# EAGLE schematic KFTP-ESP12 (EAGLE 9.7.0)
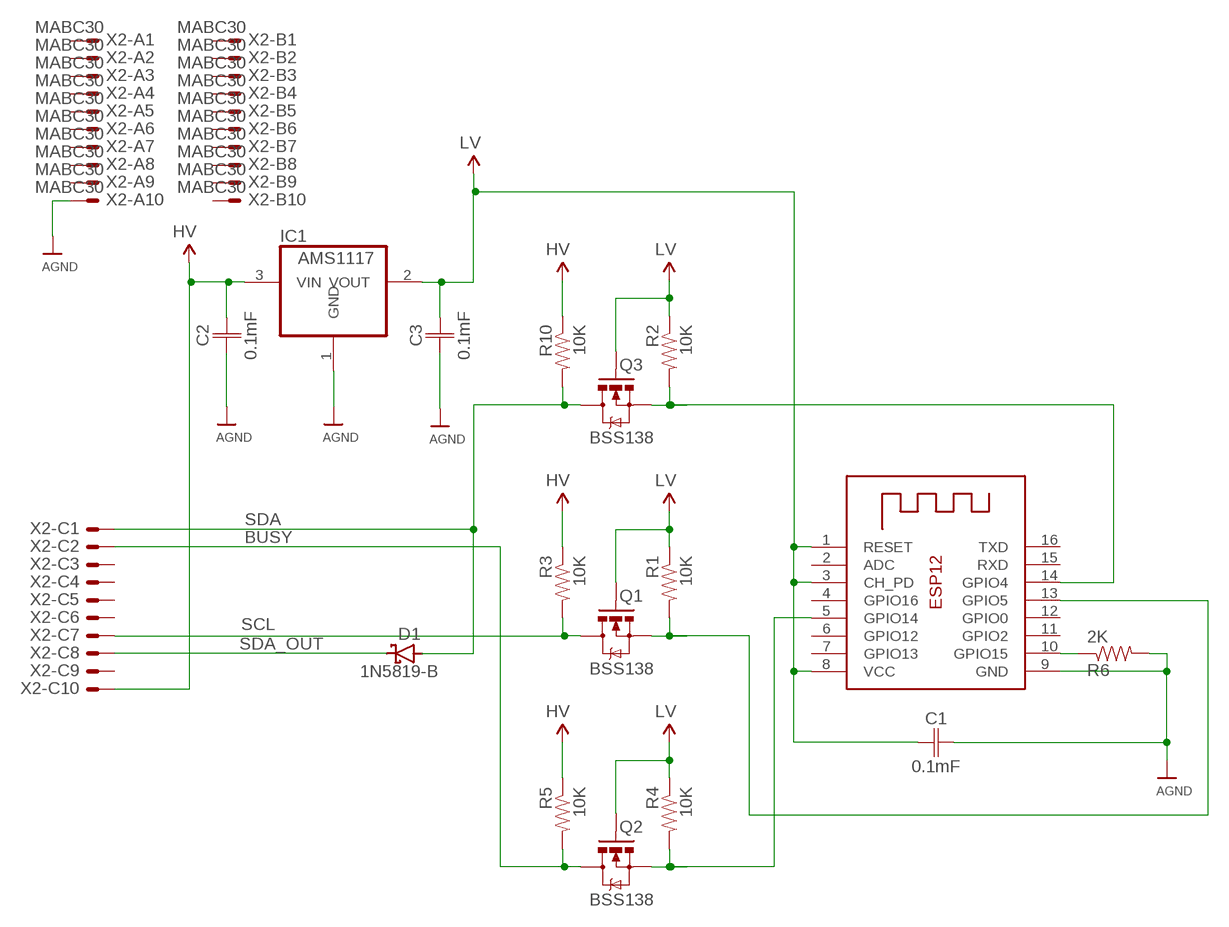
[diagram p0: schematic, sheet 1]

## Parts
C1  0.1mF  C_CHIP-1206(3216-METRIC)  [CAPC3216X135]
C2  0.1mF  C_CHIP-1206(3216-METRIC)  [CAPC3216X135]
C3  0.1mF  C_CHIP-1206(3216-METRIC)  [CAPC3216X135]
D1  1N5819-B  [DO41-7.6]
IC1  AMS1117  [SOT223]
Q1  BSS138  MOSFET-NCHANNELSMD  [SOT23-3]
Q2  BSS138  MOSFET-NCHANNELSMD  [SOT23-3]
Q3  BSS138  MOSFET-NCHANNELSMD  [SOT23-3]
R1  10K  RESISTOR0603-RES  [0603-RES]
R2  10K  RESISTOR0603-RES  [0603-RES]
R3  10K  RESISTOR0603-RES  [0603-RES]
R4  10K  RESISTOR0603-RES  [0603-RES]
R5  10K  RESISTOR0603-RES  [0603-RES]
R6  2K  RESISTOR0603-RES  [0603-RES]
R10  10K  RESISTOR0603-RES  [0603-RES]
X1  ESP-12  [ESP-12]
X2  MABC30  [MABC30]

## Nets
AGND: C1.2 C2.1 C3.1 IC1.1(GND) R6.2 X1.9(GND) X2.A10
BUSY: Q2.3(D) R5.2 X2.C2
HV: R3.1 R5.1 R10.1
LV: Q1.1(G) Q2.1(G) Q3.1(G) R1.1 R2.1 R4.1
LV1: Q1.2(S) Q2.2(S) R1.2 R4.2 X1.5(GPIO14) X1.13(GPIO5)
LV3: Q3.2(S) R2.2 X1.14(GPIO4)
N$3: R6.1 X1.10(GPIO15)
SCL: Q1.3(D) R3.2 X2.C7
SDA: D1.A Q3.3(D) R10.2 X2.C1
SDA_OUT: D1.C X2.C8
VCC: C1.1 C2.2 C3.2 IC1.2(VOUT) IC1.3(VIN) X1.1(RESET) X1.3(CH_PD) X1.8(VCC) X2.C10 ; supply symbol labelled LV, HV
Unconnected: X1.2(ADC) X1.4(GPIO16) X1.6(GPIO12) X1.7(GPIO13) X1.11(GPIO2) X1.12(GPIO0) X1.15(RXD) X1.16(TXD) X2.A1 X2.A2 X2.A3 X2.A4 X2.A5 X2.A6 X2.A7 X2.A8 X2.A9 X2.B1 X2.B2 X2.B3 X2.B4 X2.B5 X2.B6 X2.B7 X2.B8 X2.B9 X2.B10 X2.C3 X2.C4 X2.C5 X2.C6 X2.C9

## Library data of the parts
C1-C3 = Capacitor:C: Capacitor - Generic; CATEGORY: Capacitor; PACKAGE_SIZE: 1206; PACKAGE_TYPE: Surface Mount; SUBCATEGORY: Ceramic Capacitors; TYPE: MLCC
D1 = diode:1N581*: 1.0A SCHOTTKY BARRIER RECTIFIER Source: http://www.diodes.com/datasheets/ds23001.pdf
IC1 = PEC11:AMS1117: 800mA and 1A Low Dropout (LDO) Positive Regulator 1.8V, 2.5V, 2.85V, 3.3V, 5V, and Adj; MPN: REG1117; OC_FARNELL: 1097566; OC_NEWARK: 14P6981
Q1-Q3 = SparkFun:MOSFET-NCHANNEL
R1-R6 R10 = SparkFun:RESISTOR: Resistor Basic schematic elements and footprints for 0603, 1206, and PTH resistors.
X1 = adafruit:ESP-12
X2 = con-vg:MABC30: Male Connector C/3, 30 Solder DIN EN 60 603-02 Source: www.erni.com .. 424189.pdf